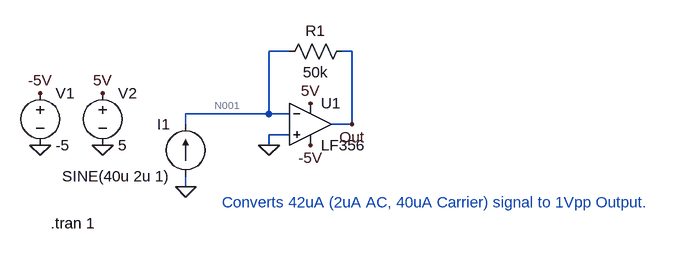
[diagram p0: schematic VtoI.asc]
VtoI.asc, the LTspice schematic file:
Version 4
SHEET 1 940 680
WIRE 336 64 304 64
WIRE 432 64 416 64
WIRE 304 160 304 64
WIRE 304 160 176 160
WIRE 336 160 304 160
WIRE 176 176 176 160
WIRE 432 176 432 64
WIRE 432 176 400 176
WIRE 336 192 304 192
WIRE 304 208 304 192
WIRE 176 272 176 256
FLAG -48 208 0
FLAG 48 208 0
FLAG 48 128 5V
FLAG 368 144 5V
FLAG -48 128 -5V
FLAG 368 208 -5V
FLAG 304 208 0
FLAG 176 272 0
FLAG 432 176 Out
SYMBOL voltage -48 112 R0
WINDOW 123 0 0 Left 0
WINDOW 39 0 0 Left 0
SYMATTR InstName V1
SYMATTR Value -5
SYMBOL voltage 48 112 R0
WINDOW 123 0 0 Left 0
WINDOW 39 0 0 Left 0
SYMATTR InstName V2
SYMATTR Value 5
SYMBOL LF356 368 112 R0
SYMATTR InstName U1
SYMBOL res 432 48 R90
WINDOW 0 0 56 VBottom 2
WINDOW 3 32 56 VTop 2
SYMATTR InstName R1
SYMATTR Value 50k
SYMBOL current 176 256 R180
WINDOW 0 24 80 Left 2
WINDOW 3 24 0 Left 2
WINDOW 123 0 0 Left 0
WINDOW 39 0 0 Left 0
SYMATTR InstName I1
SYMATTR Value SINE(40u 2u 1)
TEXT -32 328 Left 2 !.tran 1
TEXT 232 296 Left 2 ;Converts 42uA (2uA AC, 40uA Carrier) signal to 1Vpp Output.

The netlist it stands for:
* VtoI.asc
V1 -5V 0 -5
V2 5V 0 5
XU1 0 N001 5V -5V Out LF356  ; pins In+ In- V+ V- OUT
R1 Out N001 50k
I1 0 N001 SINE(40u 2u 1)
.tran 1
* Converts 42uA (2uA AC, 40uA Carrier) signal to 1Vpp Output.
.lib LF356.sub
.backanno
.end

* Results of the author's LTspice run, read from the files saved beside the schematic
* Operating Point, zero values left out:
*   V(-5v) = -5 V
*   V(5v) = 5 V
*   V(n001) = 3.01 mV
*   V(out) = -1.997 V
*   I(I1) = 40 µA
*   I(R1) = -40 µA
*   I(V1) = 4.89 mA
*   I(V2) = -4.85 mA
*   Ix(u1:1) = 31 pA
*   Ix(u1:2) = 37.01 pA
*   Ix(u1:99) = 4.85 mA
*   Ix(u1:50) = -4.89 mA
*   Ix(u1:28) = 40 µA
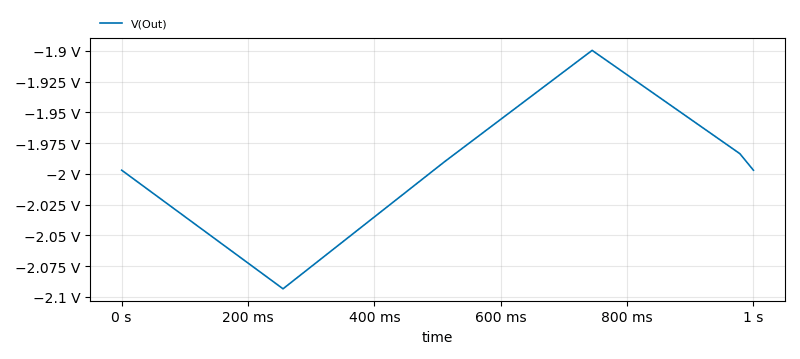
[diagram p1: Transient Analysis of VtoI.asc, plotted from the saved traces]
* Transient Analysis, 1 run:
*   V(Out): min -2.093 V, max -1.9 V, average -1.995 V, rms 1.997 V, last -1.997 V